# EAGLE design pepper-rev2 (EAGLE 9.4.2)
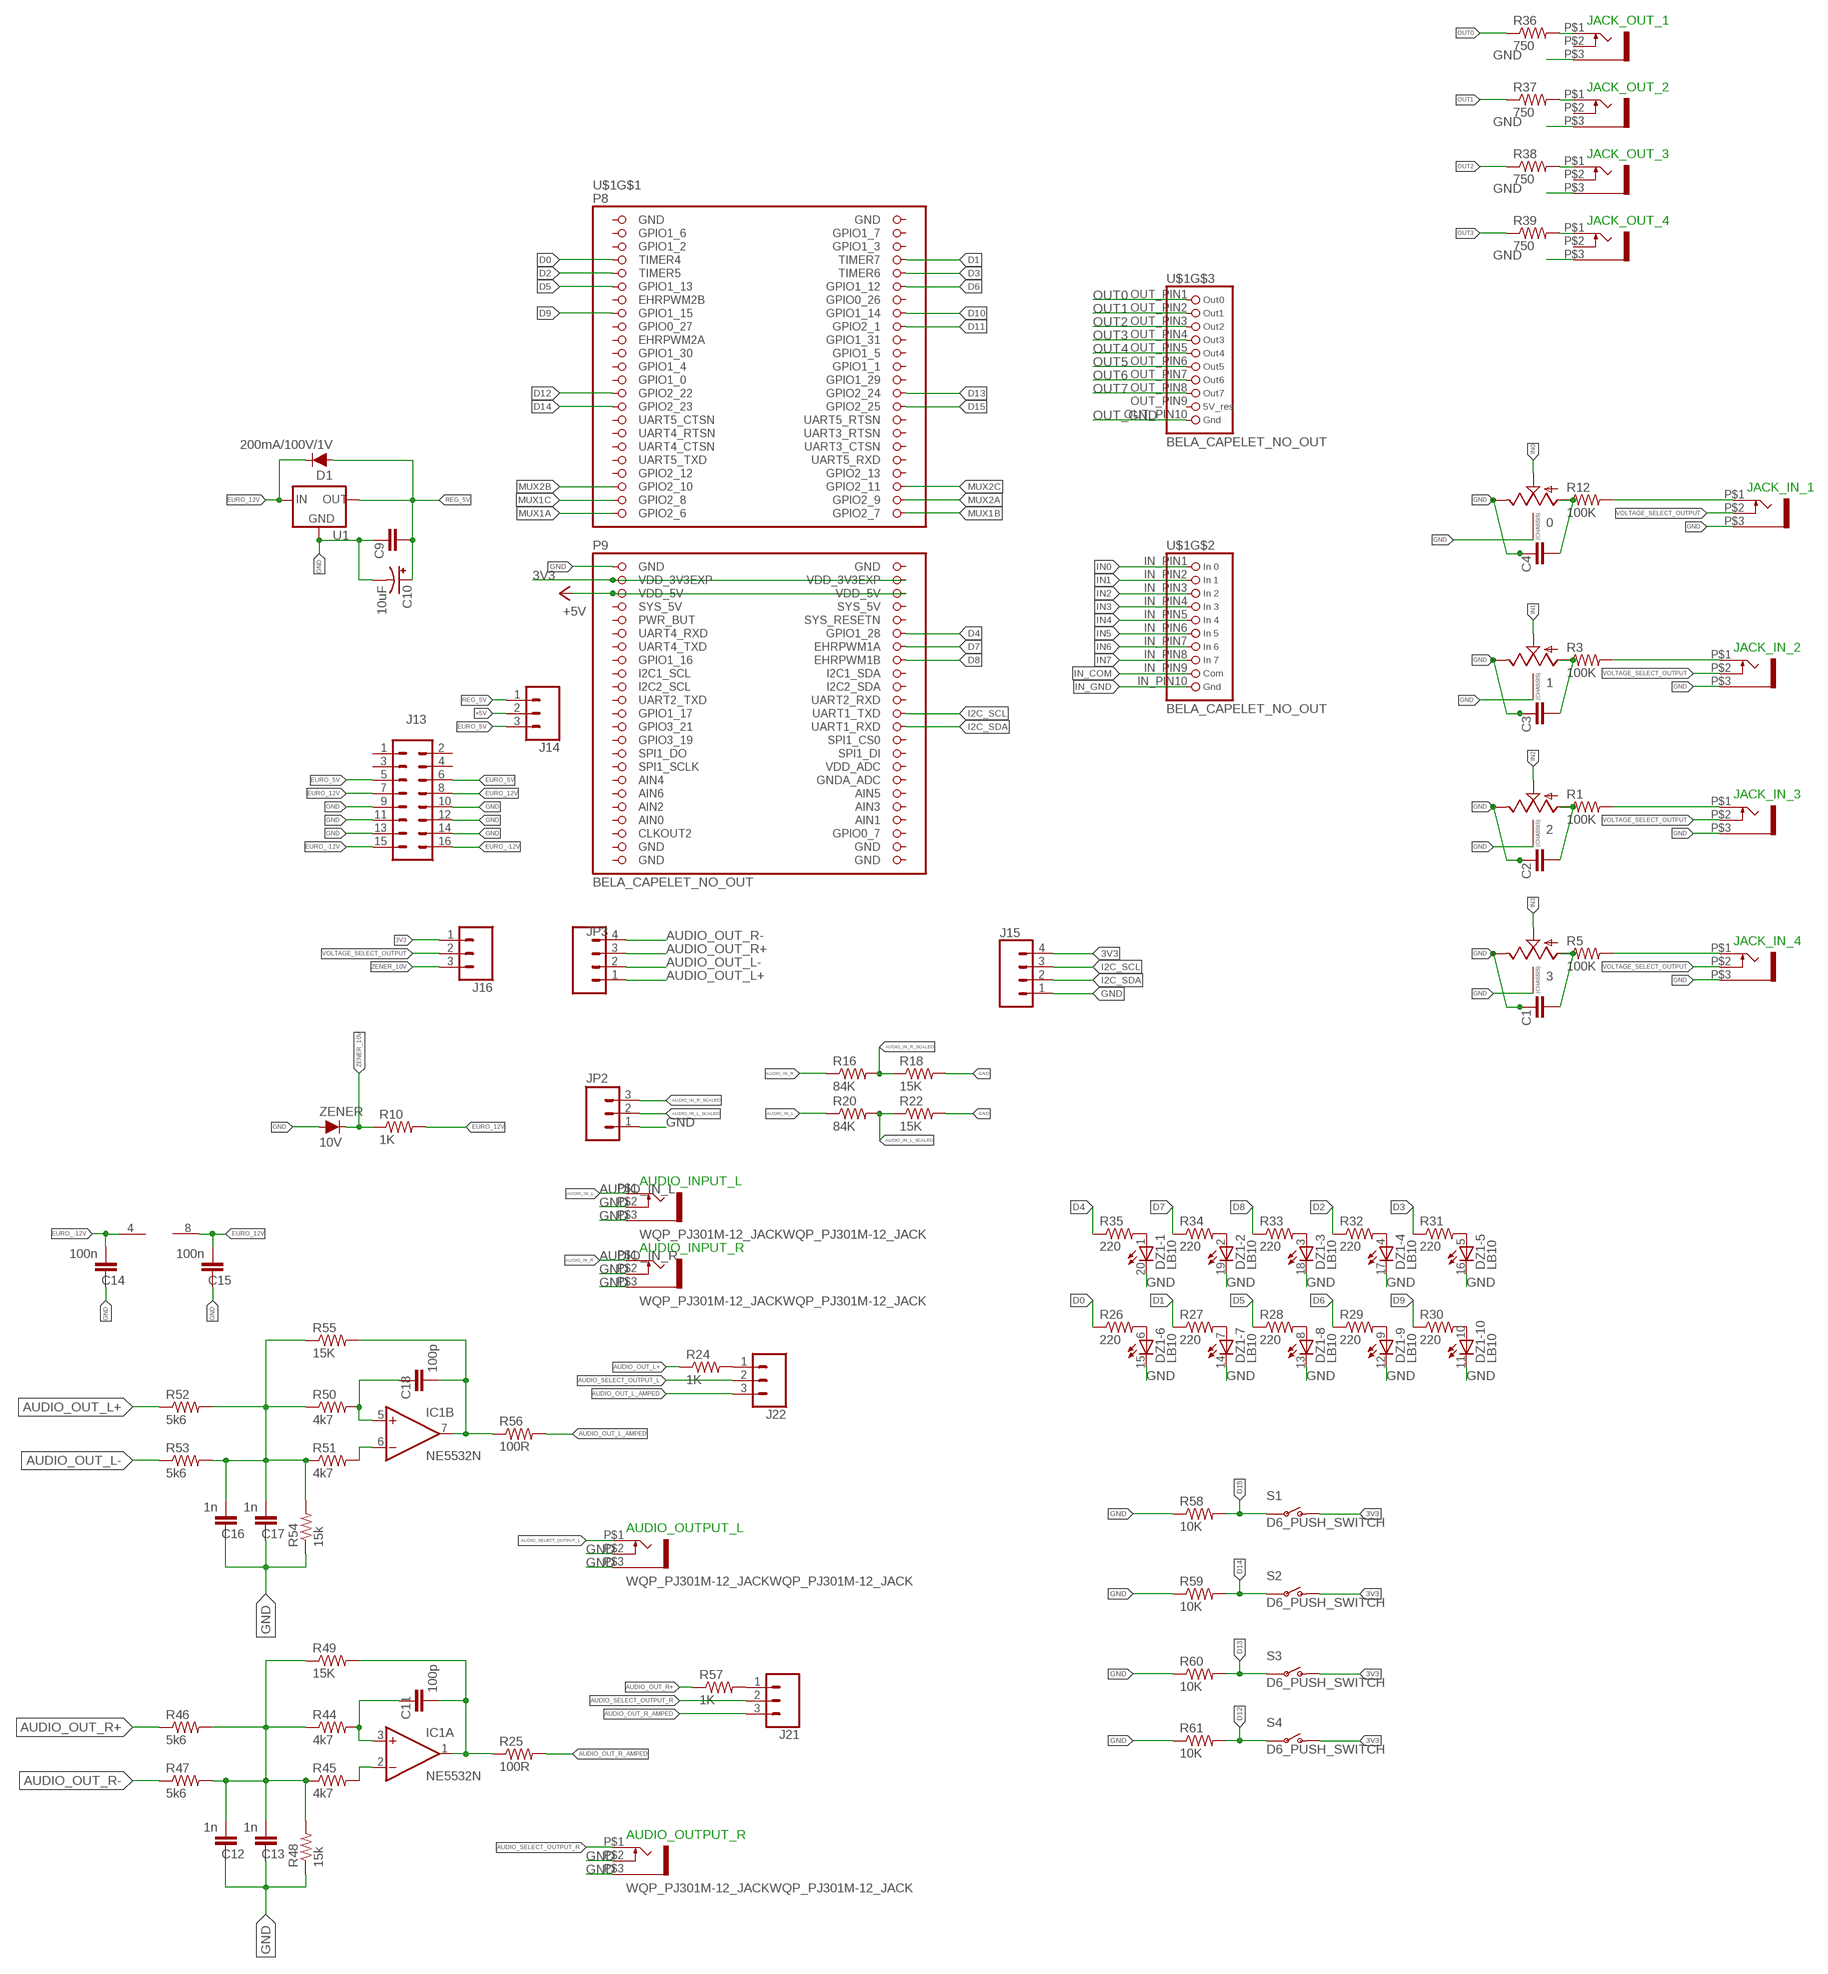
[diagram p0: schematic, sheet 1, part 1 of 2]
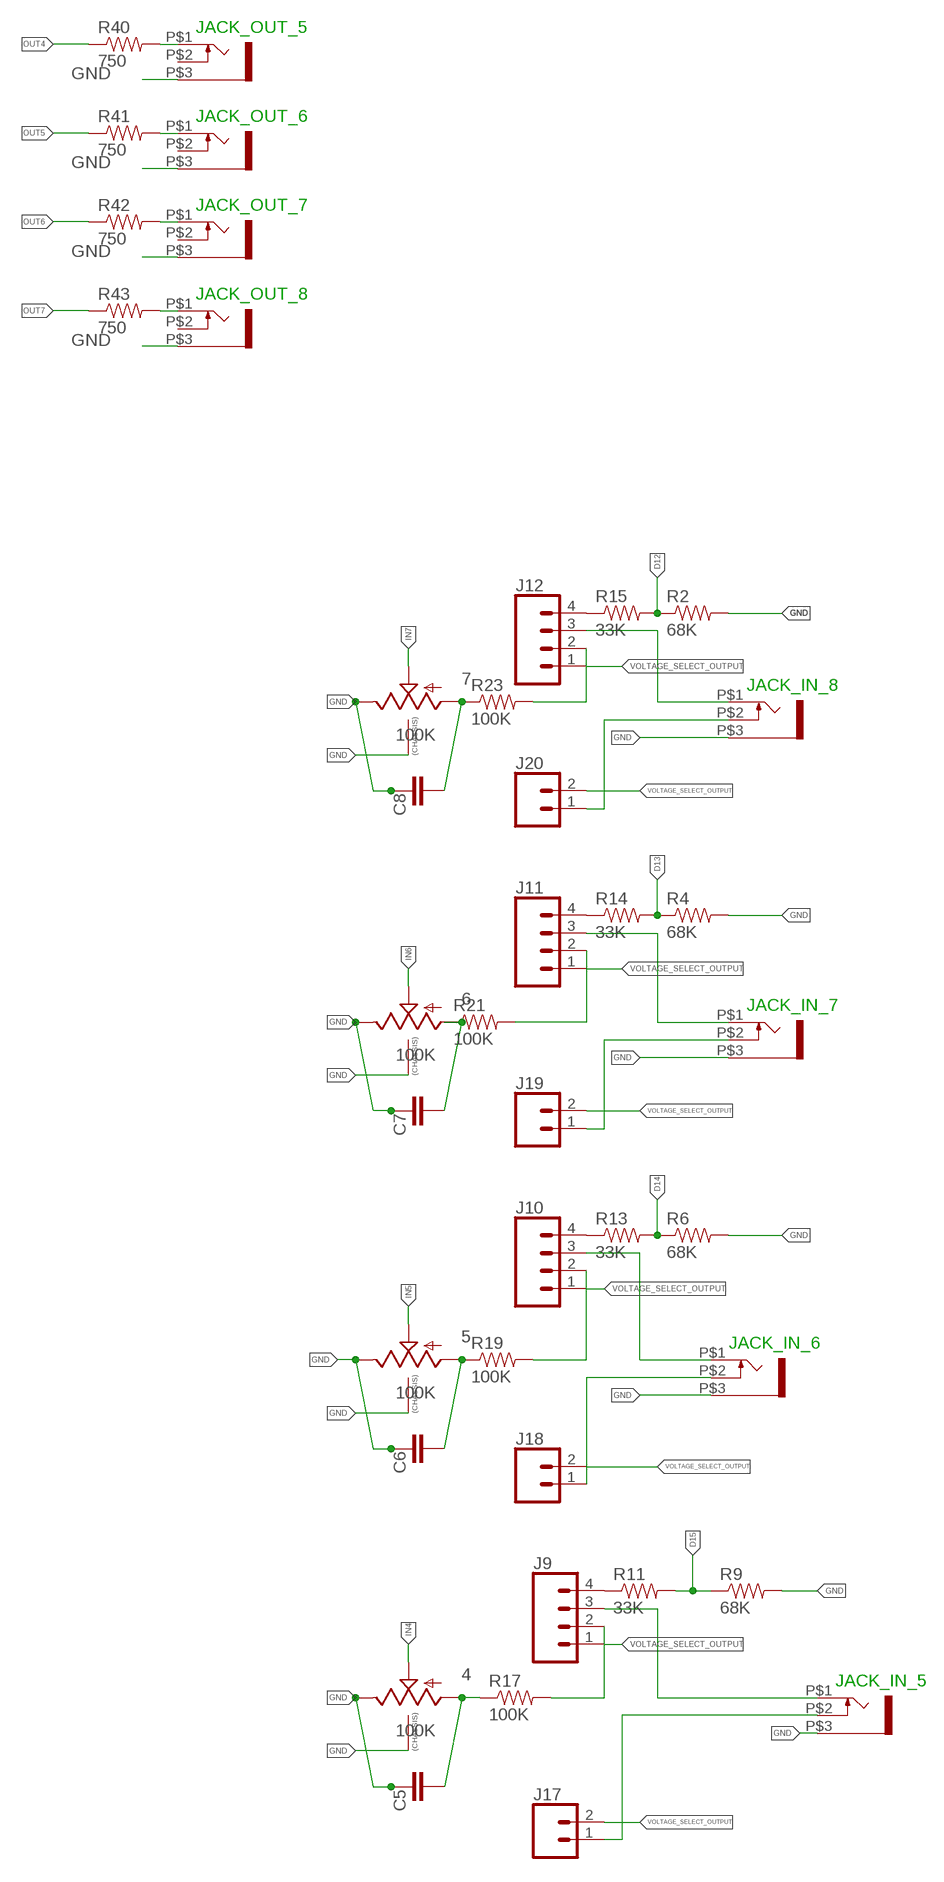
[diagram p1: schematic, sheet 1, part 2 of 2]

## Parts
0  9MM_SNAP-IN_POT_CHASSIS  [9MM_SNAP-IN_POT]
1  9MM_SNAP-IN_POT_CHASSIS  [9MM_SNAP-IN_POT]
2  9MM_SNAP-IN_POT_CHASSIS  [9MM_SNAP-IN_POT]
3  9MM_SNAP-IN_POT_CHASSIS  [9MM_SNAP-IN_POT]
4  100K  9MM_SNAP-IN_POT_CHASSIS  [9MM_SNAP-IN_POT]
5  100K  9MM_SNAP-IN_POT_CHASSIS  [9MM_SNAP-IN_POT]
6  100K  9MM_SNAP-IN_POT_CHASSIS  [9MM_SNAP-IN_POT]
7  100K  9MM_SNAP-IN_POT_CHASSIS  [9MM_SNAP-IN_POT]
AUDIO_INPUT_L  WQP_PJ301M-12_JACKWQP_PJ301M-12_JACK  [JACK-3.5]
AUDIO_INPUT_R  WQP_PJ301M-12_JACKWQP_PJ301M-12_JACK  [JACK-3.5]
AUDIO_OUTPUT_L  WQP_PJ301M-12_JACKWQP_PJ301M-12_JACK  [JACK-3.5]
AUDIO_OUTPUT_R  WQP_PJ301M-12_JACKWQP_PJ301M-12_JACK  [JACK-3.5]
C1  CAPPTH  [CAP-PTH-SMALL]
C2  CAPPTH  [CAP-PTH-SMALL]
C3  CAPPTH  [CAP-PTH-SMALL]
C4  CAPPTH  [CAP-PTH-SMALL]
C5  CAPPTH  [CAP-PTH-SMALL]
C6  CAPPTH  [CAP-PTH-SMALL]
C7  CAPPTH  [CAP-PTH-SMALL]
C8  CAPPTH  [CAP-PTH-SMALL]
C9  CAPPTH  [CAP-PTH-SMALL]
C10  10uF  10UF-POLAR-RADIAL-2.5MM-25V-20%  [CPOL-RADIAL-2.5MM-5MM]
C11  100p  CAPPTH  [CAP-PTH-SMALL]
C12  1n  CAPPTH  [CAP-PTH-SMALL]
C13  1n  CAPPTH  [CAP-PTH-SMALL]
C14  100n  CAPPTH  [CAP-PTH-SMALL]
C15  100n  CAPPTH  [CAP-PTH-SMALL]
C16  1n  CAPPTH  [CAP-PTH-SMALL]
C17  1n  CAPPTH  [CAP-PTH-SMALL]
C18  100p  CAPPTH  [CAP-PTH-SMALL]
D1  200mA/100V/1V  DIODE-1N4148  [DIODE-1N4148]
DZ1  LB10  [LB10]
IC1  NE5532N  [DIL08]
J9  CONN_04PTH  [1X04]
J10  CONN_04PTH  [1X04]
J11  CONN_04PTH  [1X04]
J12  CONN_04PTH  [1X04]
J13  2X6 FEMALE  CONN_08X2  [2X8]
J14  CONN_03  [1X03]
J15  CONN_04PTH  [1X04]
J16  CONN_03  [1X03]
J17  CONN_02  [1X02]
J18  CONN_02  [1X02]
J19  CONN_02  [1X02]
J20  CONN_02  [1X02]
J21  CONN_03  [1X03]
J22  CONN_03  [1X03]
JACK_IN_1  WQP_PJ301M-12_JACKWQP_PJ301M-12_JACK  [JACK-3.5]
JACK_IN_2  WQP_PJ301M-12_JACKWQP_PJ301M-12_JACK  [JACK-3.5]
JACK_IN_3  WQP_PJ301M-12_JACKWQP_PJ301M-12_JACK  [JACK-3.5]
JACK_IN_4  WQP_PJ301M-12_JACKWQP_PJ301M-12_JACK  [JACK-3.5]
JACK_IN_5  WQP_PJ301M-12_JACKWQP_PJ301M-12_JACK  [JACK-3.5]
JACK_IN_6  WQP_PJ301M-12_JACKWQP_PJ301M-12_JACK  [JACK-3.5]
JACK_IN_7  WQP_PJ301M-12_JACKWQP_PJ301M-12_JACK  [JACK-3.5]
JACK_IN_8  WQP_PJ301M-12_JACKWQP_PJ301M-12_JACK  [JACK-3.5]
JACK_OUT_1  WQP_PJ301M-12_JACKWQP_PJ301M-12_JACK  [JACK-3.5]
JACK_OUT_2  WQP_PJ301M-12_JACKWQP_PJ301M-12_JACK  [JACK-3.5]
JACK_OUT_3  WQP_PJ301M-12_JACKWQP_PJ301M-12_JACK  [JACK-3.5]
JACK_OUT_4  WQP_PJ301M-12_JACKWQP_PJ301M-12_JACK  [JACK-3.5]
JACK_OUT_5  WQP_PJ301M-12_JACKWQP_PJ301M-12_JACK  [JACK-3.5]
JACK_OUT_6  WQP_PJ301M-12_JACKWQP_PJ301M-12_JACK  [JACK-3.5]
JACK_OUT_7  WQP_PJ301M-12_JACKWQP_PJ301M-12_JACK  [JACK-3.5]
JACK_OUT_8  WQP_PJ301M-12_JACKWQP_PJ301M-12_JACK  [JACK-3.5]
JP2  M03PTH  [1X03@1]
JP3  CONN_04  [1X04]
R1  100K  RESISTORAXIAL-0.3  [AXIAL-0.3]
R2  68K  RESISTORAXIAL-0.3  [AXIAL-0.3]
R3  100K  RESISTORAXIAL-0.3  [AXIAL-0.3]
R4  68K  RESISTORAXIAL-0.3  [AXIAL-0.3]
R5  100K  RESISTORAXIAL-0.3  [AXIAL-0.3]
R6  68K  RESISTORAXIAL-0.3  [AXIAL-0.3]
R9  68K  RESISTORAXIAL-0.3  [AXIAL-0.3]
R10  1K  RESISTORAXIAL-0.3  [AXIAL-0.3]
R11  33K  RESISTORAXIAL-0.3  [AXIAL-0.3]
R12  100K  RESISTORAXIAL-0.3  [AXIAL-0.3]
R13  33K  RESISTORAXIAL-0.3  [AXIAL-0.3]
R14  33K  RESISTORAXIAL-0.3  [AXIAL-0.3]
R15  33K  RESISTORAXIAL-0.3  [AXIAL-0.3]
R16  84K  RESISTORAXIAL-0.3  [AXIAL-0.3]
R17  100K  RESISTORAXIAL-0.3  [AXIAL-0.3]
R18  15K  RESISTORAXIAL-0.3  [AXIAL-0.3]
R19  100K  RESISTORAXIAL-0.3  [AXIAL-0.3]
R20  84K  RESISTORAXIAL-0.3  [AXIAL-0.3]
R21  100K  RESISTORAXIAL-0.3  [AXIAL-0.3]
R22  15K  RESISTORAXIAL-0.3  [AXIAL-0.3]
R23  100K  RESISTORAXIAL-0.3  [AXIAL-0.3]
R24  1K  RESISTORAXIAL-0.3  [AXIAL-0.3]
R25  100R  RESISTORAXIAL-0.3  [AXIAL-0.3]
R26  220  RESISTORAXIAL-0.3  [AXIAL-0.3]
R27  220  RESISTORAXIAL-0.3  [AXIAL-0.3]
R28  220  RESISTORAXIAL-0.3  [AXIAL-0.3]
R29  220  RESISTORAXIAL-0.3  [AXIAL-0.3]
R30  220  RESISTORAXIAL-0.3  [AXIAL-0.3]
R31  220  RESISTORAXIAL-0.3  [AXIAL-0.3]
R32  220  RESISTORAXIAL-0.3  [AXIAL-0.3]
R33  220  RESISTORAXIAL-0.3  [AXIAL-0.3]
R34  220  RESISTORAXIAL-0.3  [AXIAL-0.3]
R35  220  RESISTORAXIAL-0.3  [AXIAL-0.3]
R36  750  RESISTORAXIAL-0.3  [AXIAL-0.3]
R37  750  RESISTORAXIAL-0.3  [AXIAL-0.3]
R38  750  RESISTORAXIAL-0.3  [AXIAL-0.3]
R39  750  RESISTORAXIAL-0.3  [AXIAL-0.3]
R40  750  RESISTORAXIAL-0.3  [AXIAL-0.3]
R41  750  RESISTORAXIAL-0.3  [AXIAL-0.3]
R42  750  RESISTORAXIAL-0.3  [AXIAL-0.3]
R43  750  RESISTORAXIAL-0.3  [AXIAL-0.3]
R44  4k7  RESISTORAXIAL-0.3  [AXIAL-0.3]
R45  4k7  RESISTORAXIAL-0.3  [AXIAL-0.3]
R46  5k6  RESISTORAXIAL-0.3  [AXIAL-0.3]
R47  5k6  RESISTORAXIAL-0.3  [AXIAL-0.3]
R48  15k  RESISTORAXIAL-0.3  [AXIAL-0.3]
R49  15K  RESISTORAXIAL-0.3  [AXIAL-0.3]
R50  4k7  RESISTORAXIAL-0.3  [AXIAL-0.3]
R51  4k7  RESISTORAXIAL-0.3  [AXIAL-0.3]
R52  5k6  RESISTORAXIAL-0.3  [AXIAL-0.3]
R53  5k6  RESISTORAXIAL-0.3  [AXIAL-0.3]
R54  15k  RESISTORAXIAL-0.3  [AXIAL-0.3]
R55  15K  RESISTORAXIAL-0.3  [AXIAL-0.3]
R56  100R  RESISTORAXIAL-0.3  [AXIAL-0.3]
R57  1K  RESISTORAXIAL-0.3  [AXIAL-0.3]
R58  10K  RESISTORAXIAL-0.3  [AXIAL-0.3]
R59  10K  RESISTORAXIAL-0.3  [AXIAL-0.3]
R60  10K  RESISTORAXIAL-0.3  [AXIAL-0.3]
R61  10K  RESISTORAXIAL-0.3  [AXIAL-0.3]
S1  D6_PUSH_SWITCH  [D6_PUSH_SWITCH]
S2  D6_PUSH_SWITCH  [D6_PUSH_SWITCH]
S3  D6_PUSH_SWITCH  [D6_PUSH_SWITCH]
S4  D6_PUSH_SWITCH  [D6_PUSH_SWITCH]
U1  V_REG_78XXSINK  [TO220-IGO]
U$1  BELA_CAPELET_NO_OUT  [BELA_CAPELET_NO_OUTLINE]
ZENER  10V  DIODE-KIT2  [DIODE-1N4001-KIT]

## Nets
1: JACK_IN_3.P$1 R1.P$2
2: JACK_IN_2.P$1 R3.P$2
3: JACK_IN_1.P$1 R12.P$2
3V3: J15.4 J16.1 S1.P$1(O) S1.P$2(O) S2.P$1(O) S2.P$2(O) S3.P$1(O) S3.P$2(O) S4.P$1(O) S4.P$2(O) U$1.49(VDD_3V3EXP) U$1.50(VDD_3V3EXP)
4: JACK_IN_4.P$1 R5.P$2
+5V: J14.2 U$1.51(VDD_5V) U$1.52(VDD_5V)
AUDIO_IN_L: AUDIO_INPUT_L.P$1 R20.P$1
AUDIO_IN_L_SCALED: JP2.2 R20.P$2 R22.P$1
AUDIO_IN_R: AUDIO_INPUT_R.P$1 R16.P$1
AUDIO_IN_R_SCALED: JP2.3 R16.P$2 R18.P$1
AUDIO_OUT_L+: JP3.1 R24.P$1 R52.P$1
AUDIO_OUT_L-: JP3.2 R53.P$1
AUDIO_OUT_L_AMPED: J22.3 R56.P$2
AUDIO_OUT_R+: JP3.3 R46.P$1 R57.P$1
AUDIO_OUT_R-: JP3.4 R47.P$1
AUDIO_OUT_R_AMPED: J21.3 R25.P$2
AUDIO_SELECT_OUTPUT_L: AUDIO_OUTPUT_L.P$1 J22.2
AUDIO_SELECT_OUTPUT_R: AUDIO_OUTPUT_R.P$1 J21.2
D0: R26.P$1 U$1.7(TIMER4)
D1: R27.P$1 U$1.8(TIMER7)
D2: R32.P$1 U$1.9(TIMER5)
D3: R31.P$1 U$1.10(TIMER6)
D4: R35.P$1 U$1.58(GPIO1_28)
D5: R28.P$1 U$1.11(GPIO1_13)
D6: R29.P$1 U$1.12(GPIO1_12)
D7: R34.P$1 U$1.60(EHRPWM1A)
D8: R33.P$1 U$1.62(EHRPWM1B)
D9: R30.P$1 U$1.15(GPIO1_15)
D10: U$1.16(GPIO1_14)
D11: U$1.18(GPIO2_1)
D12: R2.P$1 R15.P$2 R61.P$2 S4.P$3(P) S4.P$4(P) U$1.27(GPIO2_22)
D13: R4.P$1 R14.P$2 R60.P$2 S3.P$3(P) S3.P$4(P) U$1.28(GPIO2_24)
D14: R6.P$1 R13.P$2 R59.P$2 S2.P$3(P) S2.P$4(P) U$1.29(GPIO2_23)
D15: R9.P$1 R11.P$2 R58.P$2 S1.P$3(P) S1.P$4(P) U$1.30(GPIO2_25)
EURO_5V: J13.5 J13.6 J14.3
EURO_12V: C15.2 D1.C IC1.8(P:V+) J13.7 J13.8 R10.P$2 U1.IN
EURO_-12V: C14.2 IC1.4(P:V-) J13.15 J13.16
GND: 0.3(E) 0.CHASSIS1 0.CHASSIS2 1.3(E) 1.CHASSIS1 1.CHASSIS2 2.3(E) 2.CHASSIS1 2.CHASSIS2 3.3(E) 3.CHASSIS1 3.CHASSIS2 4.3(E) 4.CHASSIS1 4.CHASSIS2 5.3(E) 5.CHASSIS1 5.CHASSIS2 6.3(E) 6.CHASSIS1 6.CHASSIS2 7.3(E) 7.CHASSIS1 7.CHASSIS2 AUDIO_INPUT_L.P$2 AUDIO_INPUT_L.P$3 AUDIO_INPUT_R.P$2 AUDIO_INPUT_R.P$3 AUDIO_OUTPUT_L.P$2 AUDIO_OUTPUT_L.P$3 AUDIO_OUTPUT_R.P$2 AUDIO_OUTPUT_R.P$3 C1.1 C2.1 C3.1 C4.1 C5.1 C6.1 C7.1 C8.1 C9.1 C10.2(-) C12.1 C13.1 C14.1 C15.1 C16.1 C17.1 DZ1.11(-10:C) DZ1.12(-9:C) DZ1.13(-8:C) DZ1.14(-7:C) DZ1.15(-6:C) DZ1.16(-5:C) DZ1.17(-4:C) DZ1.18(-3:C) DZ1.19(-2:C) DZ1.20(-1:C) J13.9 J13.10 J13.11 J13.12 J13.13 J13.14 J15.1 JACK_IN_1.P$3 JACK_IN_2.P$3 JACK_IN_3.P$3 JACK_IN_4.P$3 JACK_IN_5.P$3 JACK_IN_6.P$3 JACK_IN_7.P$3 JACK_IN_8.P$3 JACK_OUT_1.P$3 JACK_OUT_2.P$3 JACK_OUT_3.P$3 JACK_OUT_4.P$3 JACK_OUT_5.P$3 JACK_OUT_6.P$3 JACK_OUT_7.P$3 JACK_OUT_8.P$3 JP2.1 R2.P$2 R4.P$2 R6.P$2 R9.P$2 R18.P$2 R22.P$2 R48.P$1 R54.P$1 R58.P$1 R59.P$1 R60.P$1 R61.P$1 U1.GND U$1.47(GND) ZENER.A
I2C_SCL: J15.3 U$1.70(UART1_TXD)
I2C_SDA: J15.2 U$1.72(UART1_RXD)
IN0: 0.2(S) U$1.IN_PIN1
IN1: 1.2(S) U$1.IN_PIN2
IN2: 2.2(S) U$1.IN_PIN3
IN3: 3.2(S) U$1.IN_PIN4
IN4: 4.2(S) U$1.IN_PIN5
IN5: 5.2(S) U$1.IN_PIN6
IN6: 6.2(S) U$1.IN_PIN7
IN7: 7.2(S) U$1.IN_PIN8
IN_COM: U$1.IN_PIN9
IN_GND: U$1.IN_PIN10
MUX1A: U$1.45(GPIO2_6)
MUX1B: U$1.46(GPIO2_7)
MUX1C: U$1.43(GPIO2_8)
MUX2A: U$1.44(GPIO2_9)
MUX2B: U$1.41(GPIO2_10)
MUX2C: U$1.42(GPIO2_11)
N$2: J10.3 JACK_IN_6.P$1
N$3: DZ1.6(-6:A) R26.P$2
N$4: DZ1.7(-7:A) R27.P$2
N$5: DZ1.8(-8:A) R28.P$2
N$6: DZ1.9(-9:A) R29.P$2
N$7: DZ1.10(-10:A) R30.P$2
N$8: DZ1.5(-5:A) R31.P$2
N$9: DZ1.4(-4:A) R32.P$2
N$10: DZ1.3(-3:A) R33.P$2
N$11: DZ1.2(-2:A) R34.P$2
N$12: DZ1.1(-1:A) R35.P$2
N$13: 1.1(A) C3.2 R3.P$1
N$14: J12.2 R23.P$2
N$15: J11.3 JACK_IN_7.P$1
N$16: 6.1(A) C7.2 R21.P$1
N$17: J9.2 R17.P$2
N$18: 5.1(A) C6.2 R19.P$1
N$19: J9.3 JACK_IN_5.P$1
N$20: J12.3 JACK_IN_8.P$1
N$21: 4.1(A) C5.2 R17.P$1
N$22: J10.4 R13.P$1
N$23: J12.4 R15.P$1
N$24: J9.4 R11.P$1
N$25: J10.2 R19.P$2
N$26: J11.2 R21.P$2
N$27: J11.4 R14.P$1
N$28: C18.1 IC1.5(B:+IN) R50.P$2
N$29: J22.1 R24.P$2
N$30: J17.1 JACK_IN_5.P$2
N$31: JACK_OUT_1.P$1 R36.P$2
N$32: J19.1 JACK_IN_7.P$2
N$33: J18.1 JACK_IN_6.P$2
N$34: J20.1 JACK_IN_8.P$2
N$35: JACK_OUT_2.P$1 R37.P$2
N$36: JACK_OUT_3.P$1 R38.P$2
N$37: JACK_OUT_4.P$1 R39.P$2
N$38: JACK_OUT_5.P$1 R40.P$2
N$39: JACK_OUT_6.P$1 R41.P$2
N$40: JACK_OUT_7.P$1 R42.P$2
N$41: JACK_OUT_8.P$1 R43.P$2
N$42: C11.1 IC1.3(A:+IN) R44.P$2
N$43: IC1.2(A:-IN) R45.P$2
N$44: C11.2 IC1.1(A:OUT) R25.P$1 R49.P$2
N$45: IC1.6(B:-IN) R51.P$2
N$46: R55.P$2
N$47: C12.2 C13.2 R44.P$1 R45.P$1 R46.P$2 R47.P$2 R48.P$2 R49.P$1
N$48: C16.2 C17.2 R50.P$1 R51.P$1 R52.P$2 R53.P$2 R54.P$2 R55.P$1
N$50: C18.2 IC1.7(B:OUT) R56.P$1
N$51: J21.1 R57.P$2
OUT0: R36.P$1 U$1.OUT_PIN1
OUT1: R37.P$1 U$1.OUT_PIN2
OUT2: R38.P$1 U$1.OUT_PIN3
OUT3: R39.P$1 U$1.OUT_PIN4
OUT4: R40.P$1 U$1.OUT_PIN5
OUT5: R41.P$1 U$1.OUT_PIN6
OUT6: R42.P$1 U$1.OUT_PIN7
OUT7: R43.P$1 U$1.OUT_PIN8
OUT_GND: U$1.OUT_PIN10
POT_IN1: 0.1(A) C4.2 R12.P$1
POT_IN3: 2.1(A) C2.2 R1.P$1
POT_IN4: 3.1(A) C1.2 R5.P$1
POT_IN8: 7.1(A) C8.2 R23.P$1
REG_5V: C9.2 C10.1(+) D1.A J14.1 U1.OUT
VOLTAGE_SELECT_OUTPUT: J9.1 J10.1 J11.1 J12.1 J16.2 J17.2 J18.2 J19.2 J20.2 JACK_IN_1.P$2 JACK_IN_2.P$2 JACK_IN_3.P$2 JACK_IN_4.P$2
ZENER_10V: J16.3 R10.P$1 ZENER.C
Unconnected: J13.1 J13.2 J13.3 J13.4 JACK_OUT_1.P$2 JACK_OUT_2.P$2 JACK_OUT_3.P$2 JACK_OUT_4.P$2 JACK_OUT_5.P$2 JACK_OUT_6.P$2 JACK_OUT_7.P$2 JACK_OUT_8.P$2 U$1.3(GPIO1_6) U$1.4(GPIO1_7) U$1.5(GPIO1_2) U$1.6(GPIO1_3) U$1.13(EHRPWM2B) U$1.14(GPIO0_26) U$1.17(GPIO0_27) U$1.19(EHRPWM2A) U$1.20(GPIO1_31) U$1.21(GPIO1_30) U$1.22(GPIO1_5) U$1.23(GPIO1_4) U$1.24(GPIO1_1) U$1.25(GPIO1_0) U$1.26(GPIO1_29) U$1.31(UART5_CTSN) U$1.32(UART5_RTSN) U$1.33(UART4_RTSN) U$1.34(UART3_RTSN) U$1.35(UART4_CTSN) U$1.36(UART3_CTSN) U$1.37(UART5_TXD) U$1.38(UART5_RXD) U$1.39(GPIO2_12) U$1.40(GPIO2_13) U$1.54(SYS_5V) U$1.55(PWR_BUT) U$1.56(SYS_RESETN) U$1.57(UART4_RXD) U$1.59(UART4_TXD) U$1.61(GPIO1_16) U$1.63(I2C1_SCL) U$1.64(I2C1_SDA) U$1.65(I2C2_SCL) U$1.66(I2C2_SDA) U$1.67(UART2_TXD) U$1.68(UART2_RXD) U$1.69(GPIO1_17) U$1.71(GPIO3_21) U$1.73(GPIO3_19) U$1.74(SPI1_CS0) U$1.75(SPI1_DO) U$1.76(SPI1_DI) U$1.77(SPI1_SCLK) U$1.78(VDD_ADC) U$1.79(AIN4) U$1.80(GNDA_ADC) U$1.81(AIN6) U$1.82(AIN5) U$1.83(AIN2) U$1.84(AIN3) U$1.86(AIN1) U$1.87(CLKOUT2) U$1.88(GPIO0_7) U$1.OUT_PIN9

## Power pins joined to a net without a drawn wire
AIN0: U$1.85(AIN0)
GND: U$1.1(GND) U$1.2(GND) U$1.48(GND) U$1.89(GND) U$1.90(GND) U$1.91(GND) U$1.92(GND)
SYS_5V: U$1.53(SYS_5V)

## Library data of the parts
0 1-7 = MusicThingModular:9MM_SNAP-IN_POT_CHASSIS: 9mm vertical snap-in pot, Alpha / Panasonic style, with a connection to the metal chassis for grounding
AUDIO_INPUT_L AUDIO_INPUT_R AUDIO_OUTPUT_L AUDIO_OUTPUT_R JACK_IN_1-JACK_IN_8 JACK_OUT_1-JACK_OUT_8 = thonkiconn_eagle_v5:WQP_PJ301M-12_JACK: 3.5mm Vertical Jack from Thonk.co.uk
C1-C9 C11-C18 = SparkFun-Capacitors:CAP: Capacitor Standard 0603 ceramic capacitor, and 0.1" leaded capacitor.
C10 = SparkFun-Capacitors:10UF-POLAR: 10.0µF polarized capacitors A capacitor is a passive two-terminal electrical component used to store electrical energy temporarily in an electric field.; PROD_ID: CAP-08440
D1 = SparkFun-DiscreteSemi:DIODE: Diode These are standard reverse protection diodes and small signal diodes. SparkFun Products: SparkFun SparkPunk Sound Kit <https://www.sparkfun.com/products/11177> SparkFun ESP8266 Thing <https://www.sparkfun.com/products/13231>; PROD_ID: DIO-08378
DZ1 = led:LB10: LED BLOCK 10-LED bar graph, DIL, Siemens
IC1 = linear:NE5532: AUDIO AMPLIFIER
J9-J12 J15 JP3 = SparkFun-Connectors:CONN_04: Multi connection point. Often used as Generic Header-pin footprint for 0.1 inch spaced/style header connections On any of the 0.1 inch spaced packages, you can populate with these: Break Away Headers - Straight <https://www.sparkfun.com/products/116> (PRT-00116) Break Away Male Headers - Right Angle <https://www.sparkfun.com/products/553> (PRT-00553) Female Headers <https://www.sparkfun.com/products/115> (PRT-00115) Break Away Headers - Machine Pin <https://www.sparkfun.com/products/117> (PRT-00117) Break Away Female Headers - Swiss Machine Pin <https://www.sparkfun.com/products/743> (PRT-00743) For SCREWTERMINALS and SPRING TERMINALS visit here: Screw Terimnals on SparkFun.com <https://www.sparkfun.com/search/results?term=Screw+Terminals> (5mm/3.5mm/2.54mm spacing) This device is also useful as a general connection point to wire up your design to another part of your project. Our various solder wires solder well into these plated through hole pads. Hook-Up Wire - Assortment (Stranded, 22 AWG) <https://www.sparkfun.com/products/11375> (PRT-11375) Hook-Up Wire - Assortment (Solid Core, 22 AWG) <https://www.sparkfun.com/products/11367> (PRT-11367) View the entire wire category on our website here <https://www.sparkfun.com/categories/141> Special notes: Molex polarized connector foot print use with SKU : PRT-08231 with associated crimp pins and housings. 1MM SMD Version SKU: PRT-10208; PROD_ID: CONN-09696
J13 = SparkFun-Connectors:CONN_08X2: Multi connection point. Often used as Generic Header-pin footprint for 0.1 inch spaced/style header connections You can populate with any combo of single row headers, but if you'd like an exact match, check this: Header - 2x8 (Male, 0.1") <https://www.sparkfun.com/products/13156> (PRT-13156) On any of the 0.1 inch spaced packages, you can populate with these: Break Away Headers - Straight <https://www.sparkfun.com/products/116> (PRT-00116) Break Away Male Headers - Right Angle <https://www.sparkfun.com/products/553> (PRT-00553) Female Headers <https://www.sparkfun.com/products/115> (PRT-00115) Break Away Headers - Machine Pin <https://www.sparkfun.com/products/117> (PRT-00117) Break Away Female Headers - Swiss Machine Pin <https://www.sparkfun.com/products/743> (PRT-00743)
J14 J16 J21 J22 = SparkFun-Connectors:CONN_03: Multi connection point. Often used as Generic Header-pin footprint for 0.1 inch spaced/style header connections On any of the 0.1 inch spaced packages, you can populate with these: Break Away Headers - Straight <https://www.sparkfun.com/products/116> (PRT-00116) Break Away Male Headers - Right Angle <https://www.sparkfun.com/products/553> (PRT-00553) Female Headers <https://www.sparkfun.com/products/115> (PRT-00115) Break Away Headers - Machine Pin <https://www.sparkfun.com/products/117> (PRT-00117) Break Away Female Headers - Swiss Machine Pin <https://www.sparkfun.com/products/743> (PRT-00743) Stackable Header - 3 Pin (Female, 0.1") <https://www.sparkfun.com/products/13875> (PRT-13875) For SCREWTERMINALS and SPRING TERMINALS visit here: Screw Terimnals on SparkFun.com <https://www.sparkfun.com/search/results?term=Screw+Terminals> (5mm/3.5mm/2.54mm spacing) This device is also useful as a general connection point to wire up your design to another part of your project. Our various solder wires solder well into these plated through hole pads. Hook-Up Wire - Assortment (Stranded, 22 AWG) <https://www.sparkfun.com/products/11375> (PRT-11375) Hook-Up Wire - Assortment (Solid Core, 22 AWG) <https://www.sparkfun.com/products/11367> (PRT-11367) View the entire wire category on our website here <https://www.sparkfun.com/categories/141> Special notes: Molex polarized connector foot print use with SKU : PRT-08232 with associated crimp pins and housings.; PROD_ID: XXX-00000; VALUE: 455-1750-1-ND
J17-J20 = SparkFun-Connectors:CONN_02: Multi connection point. Often used as Generic Header-pin footprint for 0.1 inch spaced/style header connections On any of the 0.1 inch spaced packages, you can populate with these: Break Away Headers - Straight <https://www.sparkfun.com/products/116> (PRT-00116) Break Away Male Headers - Right Angle <https://www.sparkfun.com/products/553> (PRT-00553) Female Headers <https://www.sparkfun.com/products/115> (PRT-00115) Break Away Headers - Machine Pin <https://www.sparkfun.com/products/117> (PRT-00117) Break Away Female Headers - Swiss Machine Pin <https://www.sparkfun.com/products/743> (PRT-00743) For SCREWTERMINALS and SPRING TERMINALS visit here: Screw Terimnals on SparkFun.com <https://www.sparkfun.com/search/results?term=Screw+Terminals> (5mm/3.5mm/2.54mm spacing) This device is also useful as a general connection point to wire up your design to another part of your project. Our various solder wires solder well into these plated through hole pads. Hook-Up Wire - Assortment (Stranded, 22 AWG) <https://www.sparkfun.com/products/11375> (PRT-11375) Hook-Up Wire - Assortment (Solid Core, 22 AWG) <https://www.sparkfun.com/products/11367> (PRT-11367) View the entire wire category on our website here <https://www.sparkfun.com/categories/141> Special notes: Molex polarized connector foot print use with: PRT-08233 with associated crimp pins and housings. 2.54_SCREWTERM for use with PRT-10571. 3.5mm Screw Terminal footprints for PRT-08084 5mm Screw Terminal footprints for use with PRT-08432
JP2 = SparkFun-Connectors:M03: Header 3 Standard 3-pin 0.1" header. Use with straight break away headers (SKU : PRT-00116), right angle break away headers (PRT-00553), swiss pins (PRT-00743), machine pins (PRT-00117), and female headers (PRT-00115). Molex polarized connector foot print use with SKU : PRT-08232 with associated crimp pins and housings.
R1-R6 R9-R61 = SparkFun-Resistors:RESISTOR: Generic Resistor Package
S1-S4 = MusicThingModular:D6_PUSH_SWITCH: Push switch
U1 = SparkFun-IC-Power:V_REG_78XX: Voltage Regulator Standard 78xx regulator. IGO (Input Ground Output). Spark Fun Electronics SKU : COM-00107
U$1 = custom:BELA_CAPELET: Should match A3 pinout - but not completely tested
ZENER = SparkFun-DiscreteSemi:DIODE: Diode These are standard reverse protection diodes and small signal diodes. SparkFun Products: SparkFun SparkPunk Sound Kit <https://www.sparkfun.com/products/11177> SparkFun ESP8266 Thing <https://www.sparkfun.com/products/13231>; PROD_ID: DIO-09176; VALUE: 1A/50V/1.1V

## Board
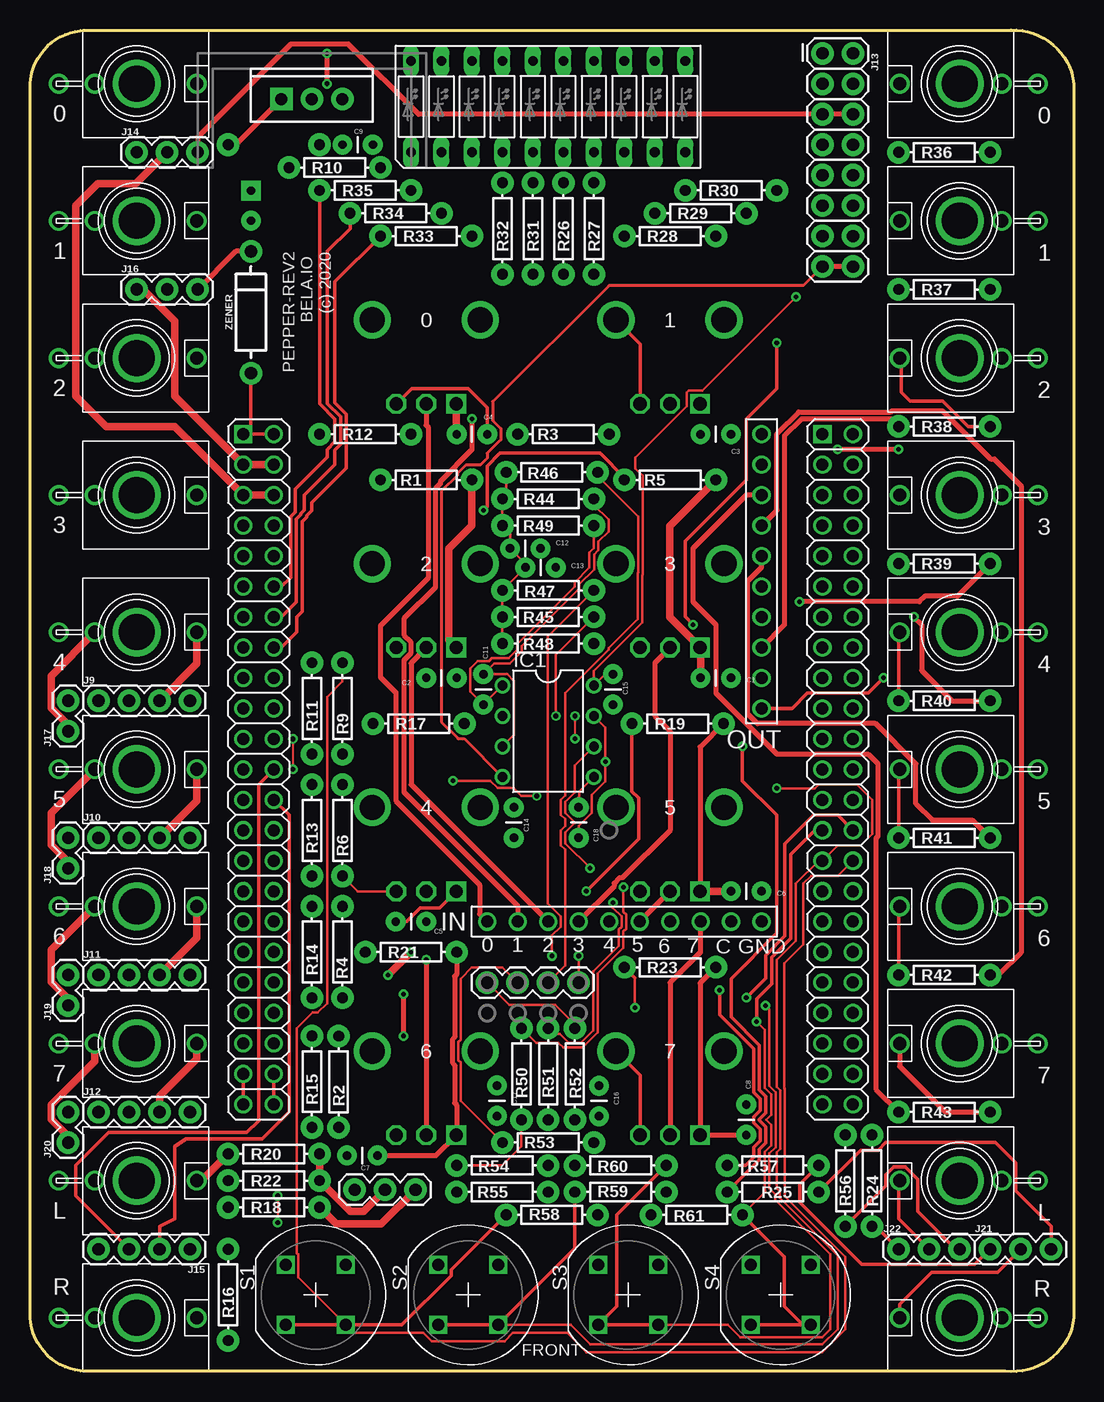
[diagram p2: board, top side]
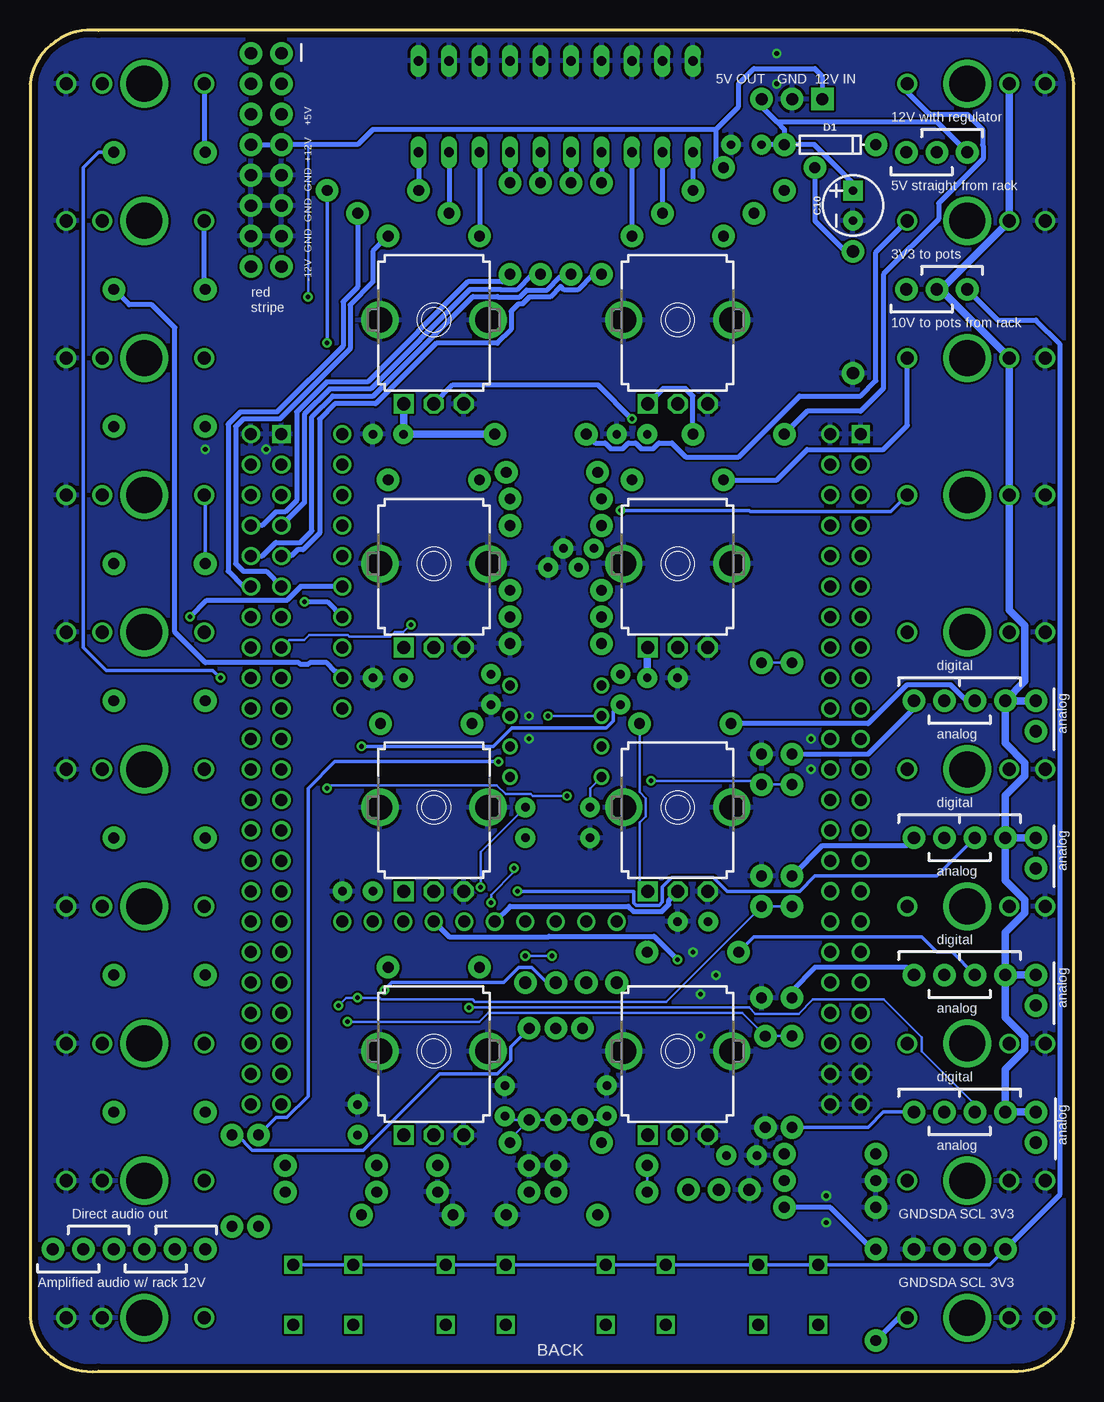
[diagram p3: board, bottom side, seen from below]

Size 87 x 111.83 mm. Coordinates in mm from the lower left corner, seen from the top.
Outline: 0,107.35 arc-90 5.08,111.8 81.28,111.8 arc-90 87,107.35 87,4.48 arc-90 81.28,0.04 5.08,0.04 arc-90 0,4.48 0,107.35
Copper layers (1*16): Top 0.035mm / dielectric 1.5mm / Bottom 0.035mm
Design rules "default *": minimum track width 7mil, minimum drill 15mil, track to track 7mil, track to pad 7mil, pad to pad 7mil, via to via 7mil, smd to smd 0mil, copper to edge 20mil, drill to drill 8mil, minimum pad ring 10mil, minimum via ring 8mil, stop-mask expansion 4mil, vias tented up to drill 20mil, thermal gap 10mil

### Footprints (pad centres in the part's own frame; a part is rotated, then mirrored left to right if it is on the bottom)
9MM_SNAP-IN_POT = drill 1.1 square: 1 -2.5,-7 | drill 1.1 octagon: 2 0,-7; 3 2.5,-7 | drill 2.1 pad 2.794: CHASSIS1 -4.5,0; CHASSIS2 4.5,0
JACK-3.5 = drill 1.1: P$1 0,5; P$2 0,-3.5; P$3 0,-6.5 | drill 3: P$4 0,0
CAP-PTH-SMALL = drill 0.7 pad 1.651: 1 0,0; 2 2.54,0
CPOL-RADIAL-2.5MM-5MM = drill 0.7 pad 1.651 square: 1 1.25,0 | drill 0.7 pad 1.651: 2 -1.25,0
DIODE-1N4148 = drill 0.9 pad 1.88: A -3.81,0; C 3.81,0
LB10 = drill 0.813 long: 1 -11.43,-3.81; 2 -8.89,-3.81; 3 -6.35,-3.81; 4 -3.81,-3.81; 5 -1.27,-3.81; 6 1.27,-3.81; 7 3.81,-3.81; 8 6.35,-3.81; 9 8.89,-3.81; 10 11.43,-3.81; 11 11.43,3.81; 12 8.89,3.81; 13 6.35,3.81; 14 3.81,3.81; 15 1.27,3.81; 16 -1.27,3.81; 17 -3.81,3.81; 18 -6.35,3.81; 19 -8.89,3.81; 20 -11.43,3.81
DIL08 = drill 0.813 pad 1.27: 1 -3.81,-3.81; 2 -1.27,-3.81; 3 1.27,-3.81; 4 3.81,-3.81; 5 3.81,3.81; 6 1.27,3.81; 7 -1.27,3.81; 8 -3.81,3.81
1X04 = drill 1.016 pad 1.88: 1 0,0; 2 2.54,0; 3 5.08,0; 4 7.62,0
2X8 = drill 1.016 pad 1.88: 1 0,0; 2 0,2.54; 3 2.54,0; 4 2.54,2.54; 5 5.08,0; 6 5.08,2.54; 7 7.62,0; 8 7.62,2.54; 9 10.16,0; 10 10.16,2.54; 11 12.7,0; 12 12.7,2.54; 13 15.24,0; 14 15.24,2.54; 15 17.78,0; 16 17.78,2.54
1X03 = drill 1.016 pad 1.88: 1 0,0; 2 2.54,0; 3 5.08,0
1X02 = drill 1.016 pad 1.88: 1 0,0; 2 2.54,0
1X03@1 = drill 1.016 pad 1.88: 1 0,0; 2 2.54,0; 3 5.08,0
AXIAL-0.3 = drill 0.9 pad 1.88: P$1 -3.81,0; P$2 3.81,0
D6_PUSH_SWITCH = drill 1 square: P$1 -2.5,2.5; P$2 2.5,2.5; P$3 2.5,-2.5; P$4 -2.5,-2.5
TO220-IGO = drill 1 pad 1.88: GND 0,0; OUT 2.54,0 | drill 1 pad 1.88 square: IN -2.54,0
BELA_CAPELET_NO_OUTLINE = drill 1 square: 1 -20.32,-31.75; 47 27.94,-31.75 | drill 1: 2 -22.86,-31.75; 3 -20.32,-29.21; 4 -22.86,-29.21; 5 -20.32,-26.67; 6 -22.86,-26.67; 7 -20.32,-24.13; 8 -22.86,-24.13; 9 -20.32,-21.59; 10 -22.86,-21.59; 11 -20.32,-19.05; 12 -22.86,-19.05; 13 -20.32,-16.51; 14 -22.86,-16.51; 15 -20.32,-13.97; 16 -22.86,-13.97; 17 -20.32,-11.43; 18 -22.86,-11.43; 19 -20.32,-8.89; 20 -22.86,-8.89; 21 -20.32,-6.35; 22 -22.86,-6.35; 23 -20.32,-3.81; 24 -22.86,-3.81; 25 -20.32,-1.27; 26 -22.86,-1.27; 27 -20.32,1.27; 28 -22.86,1.27; 29 -20.32,3.81; 30 -22.86,3.81; 31 -20.32,6.35; 32 -22.86,6.35; 33 -20.32,8.89; 34 -22.86,8.89; 35 -20.32,11.43; 36 -22.86,11.43; 37 -20.32,13.97; 38 -22.86,13.97; 39 -20.32,16.51; 40 -22.86,16.51; 41 -20.32,19.05; 42 -22.86,19.05; 43 -20.32,21.59; 44 -22.86,21.59; 45 -20.32,24.13; 46 -22.86,24.13; 48 25.4,-31.75; 49 27.94,-29.21; 50 25.4,-29.21; 51 27.94,-26.67; 52 25.4,-26.67; 53 27.94,-24.13; 54 25.4,-24.13; 55 27.94,-21.59; 56 25.4,-21.59; 57 27.94,-19.05; 58 25.4,-19.05; 59 27.94,-16.51; 60 25.4,-16.51; 61 27.94,-13.97; 62 25.4,-13.97; 63 27.94,-11.43; 64 25.4,-11.43; 65 27.94,-8.89; 66 25.4,-8.89; 67 27.94,-6.35; 68 25.4,-6.35; 69 27.94,-3.81; 70 25.4,-3.81; 71 27.94,-1.27; 72 25.4,-1.27; 73 27.94,1.27; 74 25.4,1.27; 75 27.94,3.81; 76 25.4,3.81; 77 27.94,6.35; 78 25.4,6.35; 79 27.94,8.89; 80 25.4,8.89; 81 27.94,11.43; 82 25.4,11.43; 83 27.94,13.97; 84 25.4,13.97; 85 27.94,16.51; 86 25.4,16.51; 87 27.94,19.05; 88 25.4,19.05; 89 27.94,21.59; 90 25.4,21.59; 91 27.94,24.13; 92 25.4,24.13; IN_PIN1 7.62,8.89; IN_PIN2 5.08,8.89; IN_PIN3 2.54,8.89; IN_PIN4 0,8.89; IN_PIN5 -2.54,8.89; IN_PIN6 -5.08,8.89; IN_PIN7 -7.62,8.89; IN_PIN8 -10.16,8.89; IN_PIN9 -12.7,8.89; IN_PIN10 -15.24,8.89; OUT_PIN1 -15.24,-8.89; OUT_PIN2 -15.24,-11.43; OUT_PIN3 -15.24,-13.97; OUT_PIN4 -15.24,-16.51; OUT_PIN5 -15.24,-19.05; OUT_PIN6 -15.24,-21.59; OUT_PIN7 -15.24,-24.13; OUT_PIN8 -15.24,-26.67; OUT_PIN9 -15.24,-29.21; OUT_PIN10 -15.24,-31.75
DIODE-1N4001-KIT = drill 1.016 pad 1.88: A -5.08,0; C 5.08,0

### Placement (x,y rotation side)
0  33.02,87.67 0 bottom
1  53.34,87.67 0 bottom
2  33.02,67.35 0 bottom
3  53.34,67.35 0 bottom
4  33.02,47.03 0 bottom
5  53.34,47.03 0 bottom
6  33.02,26.71 0 bottom
7  53.34,26.71 0 bottom
AUDIO_INPUT_L  8.89,15.91 270 top
AUDIO_INPUT_R  8.89,4.48 270 top
AUDIO_OUTPUT_L  77.47,15.91 90 top
AUDIO_OUTPUT_R  77.47,4.48 90 top
C1  58.42,57.82 180 top
C2  33.02,57.82 0 top
C3  58.42,78.14 180 top
C4  38.1,78.14 180 top
C5  33.02,37.5 180 top
C6  60.96,40.04 180 top
C7  26.42,18.01 0 top
C8  59.69,22.26 270 top
C9  28.58,102.27 180 top
C10  18.41,97.19 90 bottom
C11  37.78,58.14 270 top
C12  42.54,68.62 180 top
C13  43.82,67.03 180 top
C14  40.32,44.49 90 top
C15  48.58,55.6 90 top
C16  47.42,23.82 270 top
C17  38.92,23.85 270 top
C18  45.72,47.03 270 top
D1  20.32,102.27 0 bottom
DZ1  43.18,105.45 0 top
IC1  43.18,53.38 270 top
J9  5.71,55.92 0 top
J10  5.71,44.49 0 top
J11  5.71,33.06 0 top
J12  5.71,21.63 0 top
J13  66.04,109.89 270 top
J14  8.89,101.64 0 top
J15  13.34,10.2 180 top
J16  8.89,90.21 0 top
J17  3.18,53.38 90 top
J18  3.18,41.95 90 top
J19  3.18,30.52 90 top
J20  3.18,19.09 90 top
J21  80.01,10.2 0 top
J22  72.39,10.2 0 top
JACK_IN_1  8.89,107.35 270 top
JACK_IN_2  8.89,95.92 270 top
JACK_IN_3  8.89,84.49 270 top
JACK_IN_4  8.89,73.06 270 top
JACK_IN_5  8.89,61.63 270 top
JACK_IN_6  8.89,50.2 270 top
JACK_IN_7  8.89,38.77 270 top
JACK_IN_8  8.89,27.34 270 top
JACK_OUT_1  77.47,107.35 90 top
JACK_OUT_2  77.47,95.92 90 top
JACK_OUT_3  77.47,84.49 90 top
JACK_OUT_4  77.47,73.06 90 top
JACK_OUT_5  77.47,61.63 90 top
JACK_OUT_6  77.47,50.2 90 top
JACK_OUT_7  77.47,38.77 90 top
JACK_OUT_8  77.47,27.34 90 top
JP2  27.05,15.15 0 top
JP3  38.1,32.42 0 top
R1  33.02,74.33 180 top
R2  25.72,24.16 270 top
R3  44.45,78.14 180 top
R4  26.04,34.96 270 top
R5  53.34,74.33 180 top
R6  26.04,45.12 270 top
R9  26.04,55.28 270 top
R10  25.4,100.37 0 top
R11  23.5,55.28 90 top
R12  27.94,78.14 180 top
R13  23.5,45.12 90 top
R14  23.5,34.96 90 top
R15  23.5,24.17 90 top
R16  16.51,6.39 90 top
R17  32.38,54.01 180 top
R18  20.32,13.69 180 top
R19  53.98,54.01 180 top
R20  20.32,18.13 0 top
R21  31.75,34.96 180 top
R22  20.32,15.91 180 top
R23  53.34,33.69 180 top
R24  70.17,15.91 270 top
R25  61.91,14.96 0 top
R26  44.45,95.29 90 top
R27  46.99,95.29 90 top
R28  53.34,94.65 180 top
R29  55.88,96.56 180 top
R30  58.42,98.46 180 top
R31  41.91,95.29 90 top
R32  39.37,95.29 90 top
R33  33.02,94.65 0 top
R34  30.48,96.56 0 top
R35  27.94,98.46 0 top
R36  76.2,101.64 180 top
R37  76.2,90.21 180 top
R38  76.2,78.78 0 top
R39  76.2,67.35 180 top
R40  76.2,55.92 180 top
R41  76.2,44.49 180 top
R42  76.2,33.06 180 top
R43  76.2,21.63 0 top
R44  43.18,72.74 0 top
R45  43.18,62.9 0 top
R46  43.5,74.97 180 top
R47  43.18,65.12 180 top
R48  43.18,60.68 180 top
R49  43.18,70.52 0 top
R50  40.96,24.8 90 top
R51  43.18,24.8 90 top
R52  45.4,24.8 270 top
R53  43.18,19.09 0 top
R54  39.37,17.18 180 top
R55  39.37,14.96 0 top
R56  67.94,15.91 270 top
R57  61.91,17.18 0 top
R58  43.5,13.05 180 top
R59  49.21,14.96 180 top
R60  49.21,17.18 0 top
R61  55.56,13.05 0 top
S1  23.81,6.39 0 top
S2  36.51,6.39 0 top
S3  49.85,6.39 0 top
S4  62.55,6.39 0 top
U1  23.5,106.08 0 top
U$1  45.72,46.39 180 top
ZENER  18.41,88.3 90 top

### Tracks (layer width: path | path; a pad name or v marks a point on that pad's centre or on a via)
1
  Bottom 0.406: R1.P$2 24.77,74.33 22.23,76.87 15.88,76.87 13.89,78.86 JACK_IN_3.P$1
2
  Bottom 0.406: JACK_IN_2.P$1 16.51,93.3 16.51,82.59 17.78,81.32 22.86,81.32 27.94,76.24 32.34,76.24 33.51,77.4 34.59,77.4 35.06,76.94 36.06,76.94 36.53,77.4 37.13,77.4 37.6,76.94 38.6,76.94 39.07,77.4 39.9,77.4 R3.P$2
3
  Bottom 0.406: JACK_IN_1.P$1 13.89,106.64 12.07,104.81 8.89,104.81 7.62,103.54 7.62,102.23 7.57,102.18 7.57,101.09 11.28,97.38 11.28,96.07 15.88,91.48 15.88,81.95 17.78,80.05 22.23,80.05 R12.P$2
3V3
  Top 0.61: U$1.50 U$1.49 12.07,81.32 12.07,87.56 9.42,90.21 J16.1
  Bottom 0.305: J15.4 7.02,8.89 S1.P$1 S1.P$2 S2.P$1 S2.P$2 S3.P$1 S3.P$2 S4.P$1 S4.P$2
  Bottom 0.406: J16.1 6.35,87.67 3.18,87.67 1.18,85.68 1.18,14.73 J15.4
4  (via drill 0.38)
  Top 0.305: v37.78,71.79 38.1,72.11 38.1,75.49 39.16,76.55 47.52,76.55 49.53,74.54 R5.P$2
  Bottom 0.305: v37.78,71.79 27.06,71.79 26.97,71.7 15.25,71.7 JACK_IN_4.P$1
+5V
  Top 0.61: U$1.52 U$1.51 12.07,78.78 6.35,78.78 3.81,81.32 3.81,97.19 5.65,99.03 8.82,99.03 J14.2
AUDIO_IN_L
  Top 0.61: AUDIO_INPUT_L.P$1 14.29,15.91 R20.P$1
AUDIO_IN_L_SCALED
  Top 0.61: JP2.2 27.81,13.37 26.67,13.37 R22.P$1 R20.P$2
AUDIO_IN_R
  Bottom 0.406: R16.P$1 14.61,4.48 AUDIO_INPUT_R.P$1
AUDIO_IN_R_SCALED
  Top 0.61: JP2.3 29.27,12.3 25.52,12.3 R18.P$1
  Bottom 0.406: R18.P$1 20.32,13.69 16.83,10.2 R16.P$2
AUDIO_OUT_L+
  Top 0.203: R52.P$1 45.4,28.93 43.76,30.57 39.95,30.57 JP3.1
  Bottom 0.305: R52.P$1 46.95,27.06 46.95,25.92 48.06,24.82 52.85,24.82 59.21,18.45 68.47,18.45 69.74,19.72 R24.P$1
AUDIO_OUT_L-
  Top 0.2: 35.88,32.74 36.83,33.69 39.37,33.69 JP3.2
  Top 0.203: R53.P$1 35.88,22.58 35.88,25.75 35.68,25.95 35.68,27.47 35.88,27.66 35.88,32.74
AUDIO_OUT_L_AMPED
  Top 0.305: R56.P$2 71.31,15.47 71.31,16.39 71.99,17.07 72.95,17.07 73.98,16.04 73.98,13.37 77.15,10.2 J22.3
AUDIO_OUT_R+  (via drill 0.38)
  Top 0.203: JP3.3 44.6,33.84 44.6,43.5 44.23,43.87 44.23,45.1 44.6,45.47 44.6,46.04 44.23,46.41 44.23,47.64 44.6,48.01 44.6,56.57 48.21,60.17 48.21,60.32 50.63,62.74 50.63,66.54 50.68,66.59 50.68,71.28 47.31,74.65 R46.P$1
  Top 0.305: v57.47,31.79 57.47,29.75 60.3,26.91 60.3,23.28 60.85,22.74 60.85,21.78 60.3,21.24 60.3,20.74 60.85,20.2 60.85,19.24 60.3,18.7 60.3,17.84 59.64,17.18 R57.P$1
  Bottom 0.305: v57.47,31.79 56.83,32.42 47.52,32.42 46.25,33.69 45.19,33.69 43.92,32.42 JP3.3
AUDIO_OUT_R-  (via drill 0.4)
  Top 0.2: 44.21,37.93 44.21,37.07 43.5,36.36 v43.5,34.64 | JP3.4 v45.72,34.64
  Top 0.203: R47.P$1 43.14,61.28 43.14,39 44.21,37.93
  Bottom 0.2: v45.72,34.64 v43.5,34.64
AUDIO_OUT_R_AMPED
  Top 0.305: R25.P$2 69.22,18.45 70.69,18.45 71.33,19.09 80.43,19.09 82.12,17.39 82.12,15.07 85.09,12.1 J21.3
AUDIO_SELECT_OUTPUT_L
  Top 0.305: J22.2 72.39,12.74 72.39,15.91 AUDIO_OUTPUT_L.P$1
AUDIO_SELECT_OUTPUT_R
  Top 0.305: J21.2 80.65,8.29 75.15,8.29 72.47,5.61 AUDIO_OUTPUT_R.P$1
D0
  Bottom 0.406: U$1.7 64.13,72.43 64.13,79.79 62.03,81.9 58.62,81.9 50.33,90.19 47.79,90.19 47.76,90.16 46.44,90.16 45.12,91.48 R26.P$1
D1
  Bottom 0.406: U$1.8 67.65,70.52 66.51,71.66 65.73,71.66 64.77,72.62 64.77,79.99 62.27,82.48 58.86,82.48 50.5,90.84 47.63,90.84 R27.P$1
D2
  Bottom 0.406: U$1.9 65.23,67.98 64.7,68.51 64.24,68.51 62.87,69.89 62.87,79.41 61.6,80.68 58.18,80.68 53.14,85.73 48.04,85.73 46.9,86.86 46.9,88.39 46.3,88.99 45.96,88.99 45.38,89.57 43.66,89.57 42.77,90.47 42.46,90.16 41.36,90.16 40.04,91.48 R32.P$1
D3
  Bottom 0.406: U$1.10 67.65,67.98 66.51,69.12 64.46,69.12 63.5,70.08 63.5,79.6 61.79,81.32 58.38,81.32 50.09,89.61 48.04,89.61 48,89.57 46.2,89.57 45.62,90.16 43.9,90.16 42.79,91.27 42.75,91.27 42.43,90.96 R31.P$1
D4
  Top 0.305: U$1.58 20.95,65.44 21.72,66.2 21.72,71.26 22.1,71.64 22.1,73.57 24.77,76.24 24.77,76.87 25.4,77.51 25.4,79.41 24.13,80.68 R35.P$1
D5
  Bottom 0.406: U$1.11 67.31,66.71 69.22,66.71 69.85,67.35 69.85,78.78 69.22,79.41 66.17,79.41 60.32,85.26 60.32,88.94 58.42,90.84 58.42,93.38 R28.P$1
D6
  Bottom 0.406: R29.P$1 59.69,90.4 60.91,89.18 60.91,85.5 66.41,80 69.46,80 70.49,78.97 70.49,66.71 69.22,65.44 U$1.12
D7
  Top 0.305: U$1.60 20.95,62.9 22.2,64.15 22.2,71.06 22.58,71.44 22.58,71.54 22.86,71.81 22.86,73.06 25.4,75.6 25.4,76.82 25.88,77.31 25.88,79.61 24.79,80.71 24.79,93.41 26.67,95.29 R34.P$1
D8
  Top 0.305: U$1.62 20.95,60.36 22.23,61.63 22.23,62.9 22.68,63.36 22.68,70.86 23.06,71.24 23.06,71.34 23.5,71.77 23.5,72.43 26.37,75.3 26.37,79.81 25.4,80.78 25.4,90.84 R33.P$1
D9  (via drill 0.38)
  Top 0.305: v55.24,62.27 54.59,62.93 54.59,69.23 59.69,74.33 59.69,79.41 62.23,81.95 v62.23,85.76
  Bottom 0.203: v55.24,62.27 55.88,61.63 56.61,61.63 56.99,61.25 60.39,61.25 60.53,61.39 63.74,61.39 64.13,61 65.41,61 U$1.15
  Bottom 0.305: R30.P$1 v62.23,85.76
D12  (via drill 0.38)
  Top 0.2: R61.P$2 61.28,14.96 61.28,15.06 61.22,15.12 61.22,18.32 61.76,18.86 61.76,20.58 61.35,20.99 61.76,21.4 61.76,23.12 61.22,23.66 61.22,28.49 v60.55,29.16
  Top 0.305: U$1.27 65.41,45.12 63.39,43.1 63.39,36.09 61.8,34.5 61.8,32.31 60.55,31.06 v60.55,29.16 | R61.P$2 62.87,9.56 62.87,5.43 64.41,3.89 S4.P$3 S4.P$4
  Bottom 0.2: R15.P$2 R2.P$1 | R2.P$1 27.63,29.88 48.82,29.88 49.55,29.16 v60.55,29.16
  Bottom 0.61: R2.P$1
D13  (via drill 0.38)
  Top 0.2: S3.P$3 58.15,3.89 59.18,2.85 66,2.85 66.68,3.53 66.68,9.76 62.11,14.33 62.11,14.76 61.6,15.28 61.6,18.17 62.14,18.71 62.14,23.27 61.6,23.82 61.6,30.2 v61.28,30.52
  Top 0.305: U$1.28 67.31,46.39 65.3,46.39 62.91,44 62.91,36.29 61.32,34.7 61.32,32.78 v59.69,31.15 | S3.P$3 S3.P$4 48.9,5.43 48.9,13.05 R60.P$2
  Bottom 0.2: R14.P$2 R4.P$1 33.98,30.83 49.91,30.83 50.12,31.03 57.74,31.03 57.86,31.15 v59.69,31.15 60.64,31.15 v61.28,30.52
D14  (via drill 0.38)
  Top 0.2: S2.P$3 45.04,3.89 46.67,2.26 66.04,2.26 67.31,3.53 67.31,9.66 62.49,14.49 62.49,15.02 62.23,15.28 62.23,18.27 62.51,18.55 62.51,23.43 62.23,23.72 62.23,34.33 63.82,35.91 63.82,40.68 65.72,42.58 U$1.29 67.31,43.85 69.22,43.85 70.17,44.8 70.17,47.66 68.9,48.93 65.72,48.93 65.41,48.61 v62.23,48.61 | v35.24,49.25 38.36,49.25 38.98,48.63 40.31,48.63 40.96,47.98 v42.23,47.98
  Top 0.305: S2.P$4 S2.P$3 45.4,10.28 R59.P$2
  Bottom 0.2: R6.P$1 26.35,49.25 v35.24,49.25 | v42.23,47.98 45.11,47.98 45.26,48.13 47.35,48.13 48.08,48.86 61.98,48.86 v62.23,48.61
  Bottom 0.203: R13.P$2 R6.P$1
D15
  Top 0.2: U$1.30 67.31,41.31 65.09,41.31 64.45,40.68 64.45,35.6 62.87,34.01 62.87,23.61 62.89,23.59 62.89,14.61 67.94,9.56 67.94,3.53 66.04,1.62 46.35,1.62 44.77,3.21 40.24,3.21 39.56,2.54 33.46,2.54 32.79,3.21 26.99,3.21 S1.P$3 22.34,7.85 22.34,9.76 22.23,9.87 22.23,28.61 23.55,29.93 24,29.93 24.77,30.7 24.77,56.23 26.04,57.5 R9.P$1
  Top 0.305: R58.P$2 35.1,8.46 35.1,8 30.99,3.89 S1.P$3 S1.P$4
  Bottom 0.203: R11.P$2 R9.P$1
EURO_5V
  Top 0.406: J14.3 13.97,102.91 21.73,110.67 26.53,110.67 32.38,104.81 J13.5 J13.6
EURO_12V  (via drill 0.38)
  Top 0.2: IC1.8 47.94,58.14 C15.2
  Top 0.203: IC1.8 46.99,58.42 51.02,62.44 51.02,66.39 51.06,66.43 51.06,74.67 50.44,75.28 50.44,76.2 54.74,80.49 54.74,81.61 54.9,81.77 56.02,81.77 v63.82,89.57
  Top 0.406: U1.IN 17.15,102.27 D1.C
  Bottom 0.203: v63.82,89.57 63.82,102.27
  Bottom 0.406: 29.84,103.54 29.84,101 R10.P$2 | 29.84,103.54 58.42,103.54 59.69,102.27 63.82,102.27 J13.7 J13.8 | 29.84,103.54 27.94,105.45 27.94,107.35 26.67,108.62 21.59,108.62 20.95,107.99 U1.IN
EURO_-12V
  Top 0.254: J13.15 64.45,90.52 48.26,90.52 38.58,80.85 38.56,80.87 38.56,79.28 39.23,78.61 39.23,77.67 38.1,76.54 38.1,76.14 37.54,75.58 36.31,75.58 35.59,74.85 35.59,74.67 34.29,73.38 34.29,54.16 35.68,52.77 36.17,52.77 IC1.4
  Top 0.406: J13.16 J13.15
  Bottom 0.2: IC1.4 40.32,48.61 C14.2
GND  (via drill 0.38, 0.4)
  Top 0.178: v21.91,52.74 v21.91,50.2 | v45.4,54.65 v45.4,52.74 | v20.64,14.64 v20.64,12.42
  Top 0.203: R6.P$2 27.32,40.03 4.3
  Top 0.305: U$1.89 U$1.91 | U$1.90 U$1.92 | 1.CHASSIS2 50.84,85.67 1.3 | ZENER.A 18.41,78.78 U$1.47 U$1.48 | 7.CHASSIS2 50.84,24.71 7.3 | 0.3 31.8,81.95 36.51,81.95 38.1,80.36 C4.1
  Top 0.406: v31.12,31.47 v31.12,27.98 | v24.77,107.35 v24.77,109.89 | v72.39,76.87 v67.31,76.87
  Top 0.61: v31.75,34.96 v29.84,33.06
  pour Bottom: 0,107.35 arc-90 4.45,111.8 81.91,111.8 arc-90 87,106.72 87,4.48 arc-90 82.55,0.04 4.45,0.04 arc-90 0,4.48
I2C_SCL
  Top 0.305: U$1.70 19.05,48.93 19.05,20.91 18.06,19.92 6.55,19.92 3.81,17.18 3.81,14.64 J15.3
I2C_SDA
  Top 0.305: J15.2 10.8,12.1 12.07,12.74 12.07,18.77 13.02,19.4 19.37,19.4 21.59,21.63 21.59,46.39 U$1.72
IN0
  Top 0.406: 0.2 33.02,78.88 33.17,78.73 33.17,66.14 29.2,62.16 29.2,57.89 30.48,56.61 30.48,47.57 37.48,40.57 37.48,38.13 U$1.IN_PIN1
IN1  (via drill 0.38)
  Top 0.406: v36.83,79.41 36.83,76.83 34.2,74.2 34.2,74.01 33.78,73.59 33.78,65.37 31.17,62.76 31.17,61.41 31.73,60.85 31.73,59.85 31.17,59.29 31.17,48.3 40.64,38.82 U$1.IN_PIN2
  Bottom 0.406: v36.83,79.41 39.67,82.25 51.75,82.25 1.2
IN2
  Top 0.406: U$1.IN_PIN3 31.75,48.93 31.75,59.04 32.31,59.6 32.31,59.64 2.2
IN3
  Top 0.406: 3.2 52.07,59.08 52.07,54.65 53.34,53.38 53.34,45.12 49.37,41.15 49.12,41.15 48.67,40.69 48.67,40.45 U$1.IN_PIN4
IN4
  Bottom 0.406: U$1.IN_PIN5 46.99,38.77 37.14,38.77 36.7,38.34 34.34,38.34 33.76,38.92 33.76,39.29 4.2
IN5
  Top 0.406: 5.2 53.32,40.03 U$1.IN_PIN6
IN6  (via drill 0.38)
  Top 0.406: v33.02,34.33 6.2
  Bottom 0.406: U$1.IN_PIN7 52.07,36.23 43.78,36.23 43.73,36.28 34.98,36.28 v33.02,34.33
IN7
  Top 0.406: U$1.IN_PIN8 55.88,34.96 53.34,32.42 7.2
N$2
  Top 0.61: JACK_IN_6.P$1 13.89,47.58 J10.3
N$3
  Bottom 0.406: DZ1.6 R26.P$2
N$4
  Bottom 0.406: DZ1.7 R27.P$2
N$5
  Bottom 0.406: DZ1.8 R28.P$2
N$6
  Bottom 0.406: DZ1.9 R29.P$2
N$7
  Bottom 0.406: DZ1.10 R30.P$2
N$8
  Bottom 0.406: DZ1.5 R31.P$2
N$9
  Bottom 0.406: DZ1.4 R32.P$2
N$10
  Bottom 0.406: DZ1.3 R33.P$2
N$11
  Bottom 0.406: DZ1.2 R34.P$2
N$12
  Bottom 0.406: DZ1.1 R35.P$2
N$13
  Bottom 0.61: R3.P$1 C3.2 55.84,78.18 1.1
N$14  (via drill 0.38)
  Top 0.2: 50.4,32.82 v50.4,30.34
  Top 0.305: R23.P$2 50.4,32.82
  Bottom 0.2: J12.2 8.26,22.26 12.68,26.69 12.68,27.84 15.86,31.02 21.76,31.02 22.95,29.83 26.57,29.83 27.08,30.34 v50.4,30.34
N$15
  Top 0.61: JACK_IN_7.P$1 13.89,36.15 J11.3
N$16
  Top 0.406: C7.2 33.82,18.01 6.1 35.56,19.75 35.56,22.21 35.4,22.38 35.4,25.55 35.2,25.75 35.2,27.67 35.4,27.86 35.4,32.94 35.56,33.1 R21.P$1
N$17
  Bottom 0.406: J9.2 8.93,55.92 10.25,57.24 13.92,57.24 17.15,54.01 R17.P$2
N$18
  Top 0.406: R19.P$1 55.84,52.07 5.1
  Top 0.61: 5.1 58.41,40.03 C6.2
N$19
  Top 0.61: JACK_IN_5.P$1 13.89,59.01 J9.3
N$20
  Top 0.61: JACK_IN_8.P$1 13.89,26.07 10.8,22.98 J12.3
N$21
  Top 0.305: 4.1 34.15,38.66 32.54,38.66 31.39,37.5 C5.2
  Bottom 0.203: 4.1 36.2,40.7 36.2,45.75 35.68,46.27 35.68,47.79 36.2,48.3 R17.P$1
N$22
  Bottom 0.406: J10.4 13.97,43.85 20.95,43.85 R13.P$1
N$23
  Bottom 0.305: J12.4 15.88,21.63 17.15,20.36 R15.P$1
N$24
  Bottom 0.406: J9.4 13.34,55.28 17.15,51.47 R11.P$1
N$25  (via drill 0.38)
  Top 0.305: R19.P$2 50.16,48.37 50.73,47.81 50.73,44.41 v46.35,40.04
  Bottom 0.305: J10.2 11.43,41.31 21.59,41.31 22.86,40.04 28.9,40.04 30.04,41.18 33.5,41.18 34.29,40.39 34.29,39.14 34.56,38.87 36.48,38.87 36.68,39.06 36.68,40.04 v46.35,40.04
N$26
  Bottom 0.305: J11.2 10.16,34.96 11.43,34.96 12.7,36.23 26.67,36.23 R21.P$2
N$27
  Bottom 0.406: J11.4 13.97,33.69 21.59,33.69 23.5,31.79 R14.P$1
N$28  (via drill 0.38)
  Top 0.203: C18.1 45.72,47.91 45.78,47.97 45.78,48.36 IC1.5 | v49.44,40.37 49.44,38.32 49.67,38.09 49.67,36.92 49.44,36.68 49.44,35.33 47.32,33.21 47.32,28.27 46.07,27.01 44.42,27.01 44.02,27.41 44,27.39 42.18,27.39 R50.P$2
  Bottom 0.203: C18.1 49.44,43.3 v49.44,40.37
N$29
  Top 0.305: R24.P$2 70.49,12.1 J22.1
N$30
  Top 0.61: J17.1 3.18,53.9 1.75,55.33 1.75,57.99 JACK_IN_5.P$2
N$31
  Bottom 0.406: JACK_OUT_1.P$1 72.47,101.72 R36.P$2
N$32
  Top 0.61: J19.1 3.18,31.04 1.75,32.47 1.75,35.13 JACK_IN_7.P$2
N$33
  Top 0.61: J18.1 3.18,42.47 1.75,43.9 1.75,46.56 JACK_IN_6.P$2
N$34
  Top 0.61: JACK_IN_8.P$2 5.39,25.85 1.75,22.22 1.75,21.04 3.18,19.61 J20.1
N$35
  Bottom 0.406: R37.P$2 72.47,90.29 JACK_OUT_2.P$1
N$36
  Top 0.305: R38.P$2 78.19,78.78 76.06,80.9 73.34,80.9 72.61,81.63 72.61,84.35 JACK_OUT_3.P$1
N$37
  Bottom 0.305: JACK_OUT_4.P$1 72.39,72.98 R39.P$2
N$38
  Top 0.305: JACK_OUT_5.P$1 72.39,61.55 R40.P$2
N$39
  Top 0.305: JACK_OUT_6.P$1 72.39,50.12 R41.P$2
N$40
  Top 0.305: JACK_OUT_7.P$1 72.39,38.69 R42.P$2
N$41
  Top 0.406: JACK_OUT_8.P$1 72.47,25.44 76.28,21.63 R43.P$2
N$42
  Top 0.203: R44.P$2 46.99,72.25 48.21,71.03 48.21,70.02 47.37,69.18 47.37,68.48 47,68.11 47,66.86 45.77,65.63 45.77,65.27 40.97,60.47 40.97,60.02 39.98,59.03 38.67,59.03 C11.1 39.07,58.14 39.07,58.13 39.76,58.13 40.31,57.58 40.31,57.52 40.32,57.5 40.32,53.06 IC1.3
N$43  (via drill 0.38)
  Top 0.203: R45.P$2 43.82,59.73 v43.82,54.65
  Bottom 0.203: v43.82,54.65 IC1.2
N$44  (via drill 0.38)
  Top 0.203: R49.P$2 46.99,68.63 46.62,68.27 46.62,67.02 45.39,65.79 45.39,65.43 40.59,60.63 40.59,60.17 39.88,59.46 38.48,59.46 38.27,59.24 37.33,59.24 36.68,58.6 36.68,56.7 C11.2 IC1.1
  Top 0.305: v59.37,52.11 59.37,49.25 62.23,46.39 62.23,36.55 58.42,32.74 58.42,29.56 60.79,27.2 60.79,23.48 61.33,22.94 61.33,21.58 60.79,21.04 60.79,20.94 61.33,20.4 61.33,19.04 60.79,18.5 60.79,17.64 R25.P$1
  Bottom 0.305: C11.2 38.38,55 38.38,54.24 38.96,53.66 46.84,53.66 48.39,52.11 v59.37,52.11
N$45  (via drill 0.38)
  Top 0.203: IC1.6 45.4,50.52 45.4,48.27 44.62,47.48 44.62,46.57 45.4,45.78 45.4,45.73 44.62,44.94 44.62,44.03 46.67,41.97 v46.67,41.95 | v48.58,39.09 48.58,38.65 49.29,37.93 49.29,37.07 49.06,36.84 49.06,35.49 46.94,33.36 46.94,28.42 45.91,27.39 44.9,27.39 44.15,28.14 43.65,28.14 R51.P$2
  Bottom 0.203: v46.67,41.95 46.67,41.63 48.58,39.72 v48.58,39.09
N$47
  Top 0.203: R46.P$2 39.69,73.06 R44.P$1 R49.P$1 40.01,69.89 C12.2 41.27,67.35 C13.2 R47.P$2 R45.P$1 R48.P$2
N$48
  Top 0.203: R54.P$2 39.37,17.18 40.96,18.77 R50.P$1
  Bottom 0.2: C16.2 47.13,20.99 R52.P$2 46.99,19.4 R53.P$2 | R50.P$1 39.24,20.99 C17.2
  Bottom 0.203: R50.P$1 R51.P$1 R52.P$2 | R54.P$2 R55.P$1
N$50  (via drill 0.38)
  Top 0.203: IC1.7 47.94,53.69 v47.94,50.84 47.94,49.25 47.93,49.24 47.93,49.18 46.82,48.07 46.82,46.57 45.72,45.46 C18.2
  Bottom 0.305: R56.P$1 66.49,21.18 65.59,21.18 63.82,22.95 63.82,48.61 61.6,50.84 v47.94,50.84
N$51
  Top 0.305: R57.P$2 64.13,15.59 64.13,14.12 69.32,8.93 78.74,8.93 J21.1
OUT0  (via drill 0.38)
  Top 0.305: v71.12,57.82 69.85,56.55 64.77,56.55 63.5,55.28 U$1.OUT_PIN1
  Bottom 0.305: v71.12,57.82 71.75,58.46 80.65,58.46 82.55,60.36 82.55,100.37 81.28,101.64 R36.P$1
OUT1
  Bottom 0.406: R37.P$1 78.74,88.94 76.84,88.94 74.93,87.03 74.93,61.63 72.39,59.09 64.6,59.09 64.46,58.95 63.81,58.95 63.67,59.09 62.28,59.09 61.56,58.37 61.51,58.37 U$1.OUT_PIN2
OUT2
  Top 0.406: U$1.OUT_PIN3 62.87,62.27 62.87,77.98 64.3,79.41 71.75,79.41 R38.P$1
OUT3  (via drill 0.38)
  Top 0.406: R39.P$1 77.3,64.63 74.59,64.63 74.12,64.17 v64.13,64.17
  Bottom 0.406: v64.13,64.17 62.23,64.17 U$1.OUT_PIN4
OUT4  (via drill 0.38)
  Top 0.406: v73.66,62.9 74.29,62.27 74.29,58.46 76.84,55.92 R40.P$1
  Bottom 0.406: U$1.OUT_PIN5 64.44,65.44 65.57,64.31 72.25,64.31 v73.66,62.9
OUT5
  Top 0.406: R41.P$1 78.57,45.93 75.22,45.93 73.83,47.32 73.83,50.66 70.49,54.01 60.63,54.01 59.82,54.81 59.82,65.91 60.96,67.05 U$1.OUT_PIN6
OUT6
  Top 0.406: U$1.OUT_PIN7 62.23,71.79 62.23,78.17 64.06,80 71.74,80 71.84,80.1 76.04,80.1 80.07,76.06 80.35,76.06 82.6,73.82 82.6,34.91 80.75,33.06 R42.P$1
OUT7
  Top 0.406: U$1.OUT_PIN8 59.69,73.06 55.24,68.62 55.24,64.17 57.15,62.27 57.15,56.55 62.23,51.47 69.85,51.47 70.65,50.67 70.65,44.6 70.49,44.44 70.49,23.53 R43.P$1
POT_IN1
  Top 0.61: 0.1 35.52,78.18 C4.2
  Bottom 0.406: R12.P$1 31.75,81.32 32.38,81.95 34.23,81.95 0.1
POT_IN3
  Top 0.61: R1.P$1 36.83,70.52 34.9,68.59 34.9,60.97 2.1
  Bottom 0.61: 2.1 35.56,60.31 C2.2
POT_IN4
  Top 0.61: C1.2 55.88,60.31 3.1 53.3,62.89 53.3,70.48 R5.P$1
POT_IN8
  Top 0.406: R23.P$1 55.84,32.38 7.1 55.85,19.72 C8.2
REG_5V
  Bottom 0.406: U1.OUT 26.04,105.45 24.77,104.18 | 24.77,104.18 11.43,104.18 J14.1 | 24.77,104.18 24.13,103.54 D1.A | 19.05,99.7 18.41,99.06 C10.1 | 19.05,99.7 | 19.05,99.7 21.63,102.27 D1.A | D1.A C9.2
VOLTAGE_SELECT_OUTPUT
  Bottom 0.61: 11.08,90.21 J16.2 11.08,90.21 | 11.08,90.21 5.39,95.9 JACK_IN_2.P$2 JACK_IN_1.P$2 | 11.08,90.21 5.39,84.51 JACK_IN_3.P$2 JACK_IN_4.P$2 5.39,63.48 4.08,62.17 4.08,57.55 J9.1 | J9.1 5.71,52.38 4.08,50.74 4.08,49.66 5.71,48.03 J10.1 | J10.1 5.71,40.95 4.08,39.31 4.08,38.23 5.71,36.6 J11.1 | J11.1 5.71,29.52 4.08,27.88 4.08,26.8 5.71,25.17 J12.1 J20.2 | J17.2 J9.1 | J18.2 J10.1 | J19.2 J11.1
ZENER_10V
  Top 0.406: ZENER.C 17.15,93.38 J16.3
  Bottom 0.406: R10.P$1 21.59,95.92 19.05,93.38 ZENER.C

### Text on the board
tPlace: PEPPER-REV2 / BELA.IO / (c) 2020 | OUT | IN | 0 | 1 | 2 | 3 | 4 | 5 | 6 | 7 | C | GND
tNames: 0 | 0 | 1 | 1 | 2 | 2 | 3 | 3 | 4 | 4 | 5 | 5 | 6 | 6 | 7 | 7 | L | L | R | R | FRONT
bNames: 12V IN | GND | 5V OUT | +5V | 12V with regulator | +12V | GND | 5V straight from rack | GND | GND | 3V3 to pots | -12V | red | stripe | 10V to pots from rack | digital | analog | analog | digital | analog | analog | digital | analog | analog | digital | analog | analog | 3V3 | SCL | SDA | GND | Direct audio out | 3V3 | SCL | SDA | GND | Amplified audio w/ rack 12V | BACK